# EAGLE design cutoff (EAGLE 7.7.0)
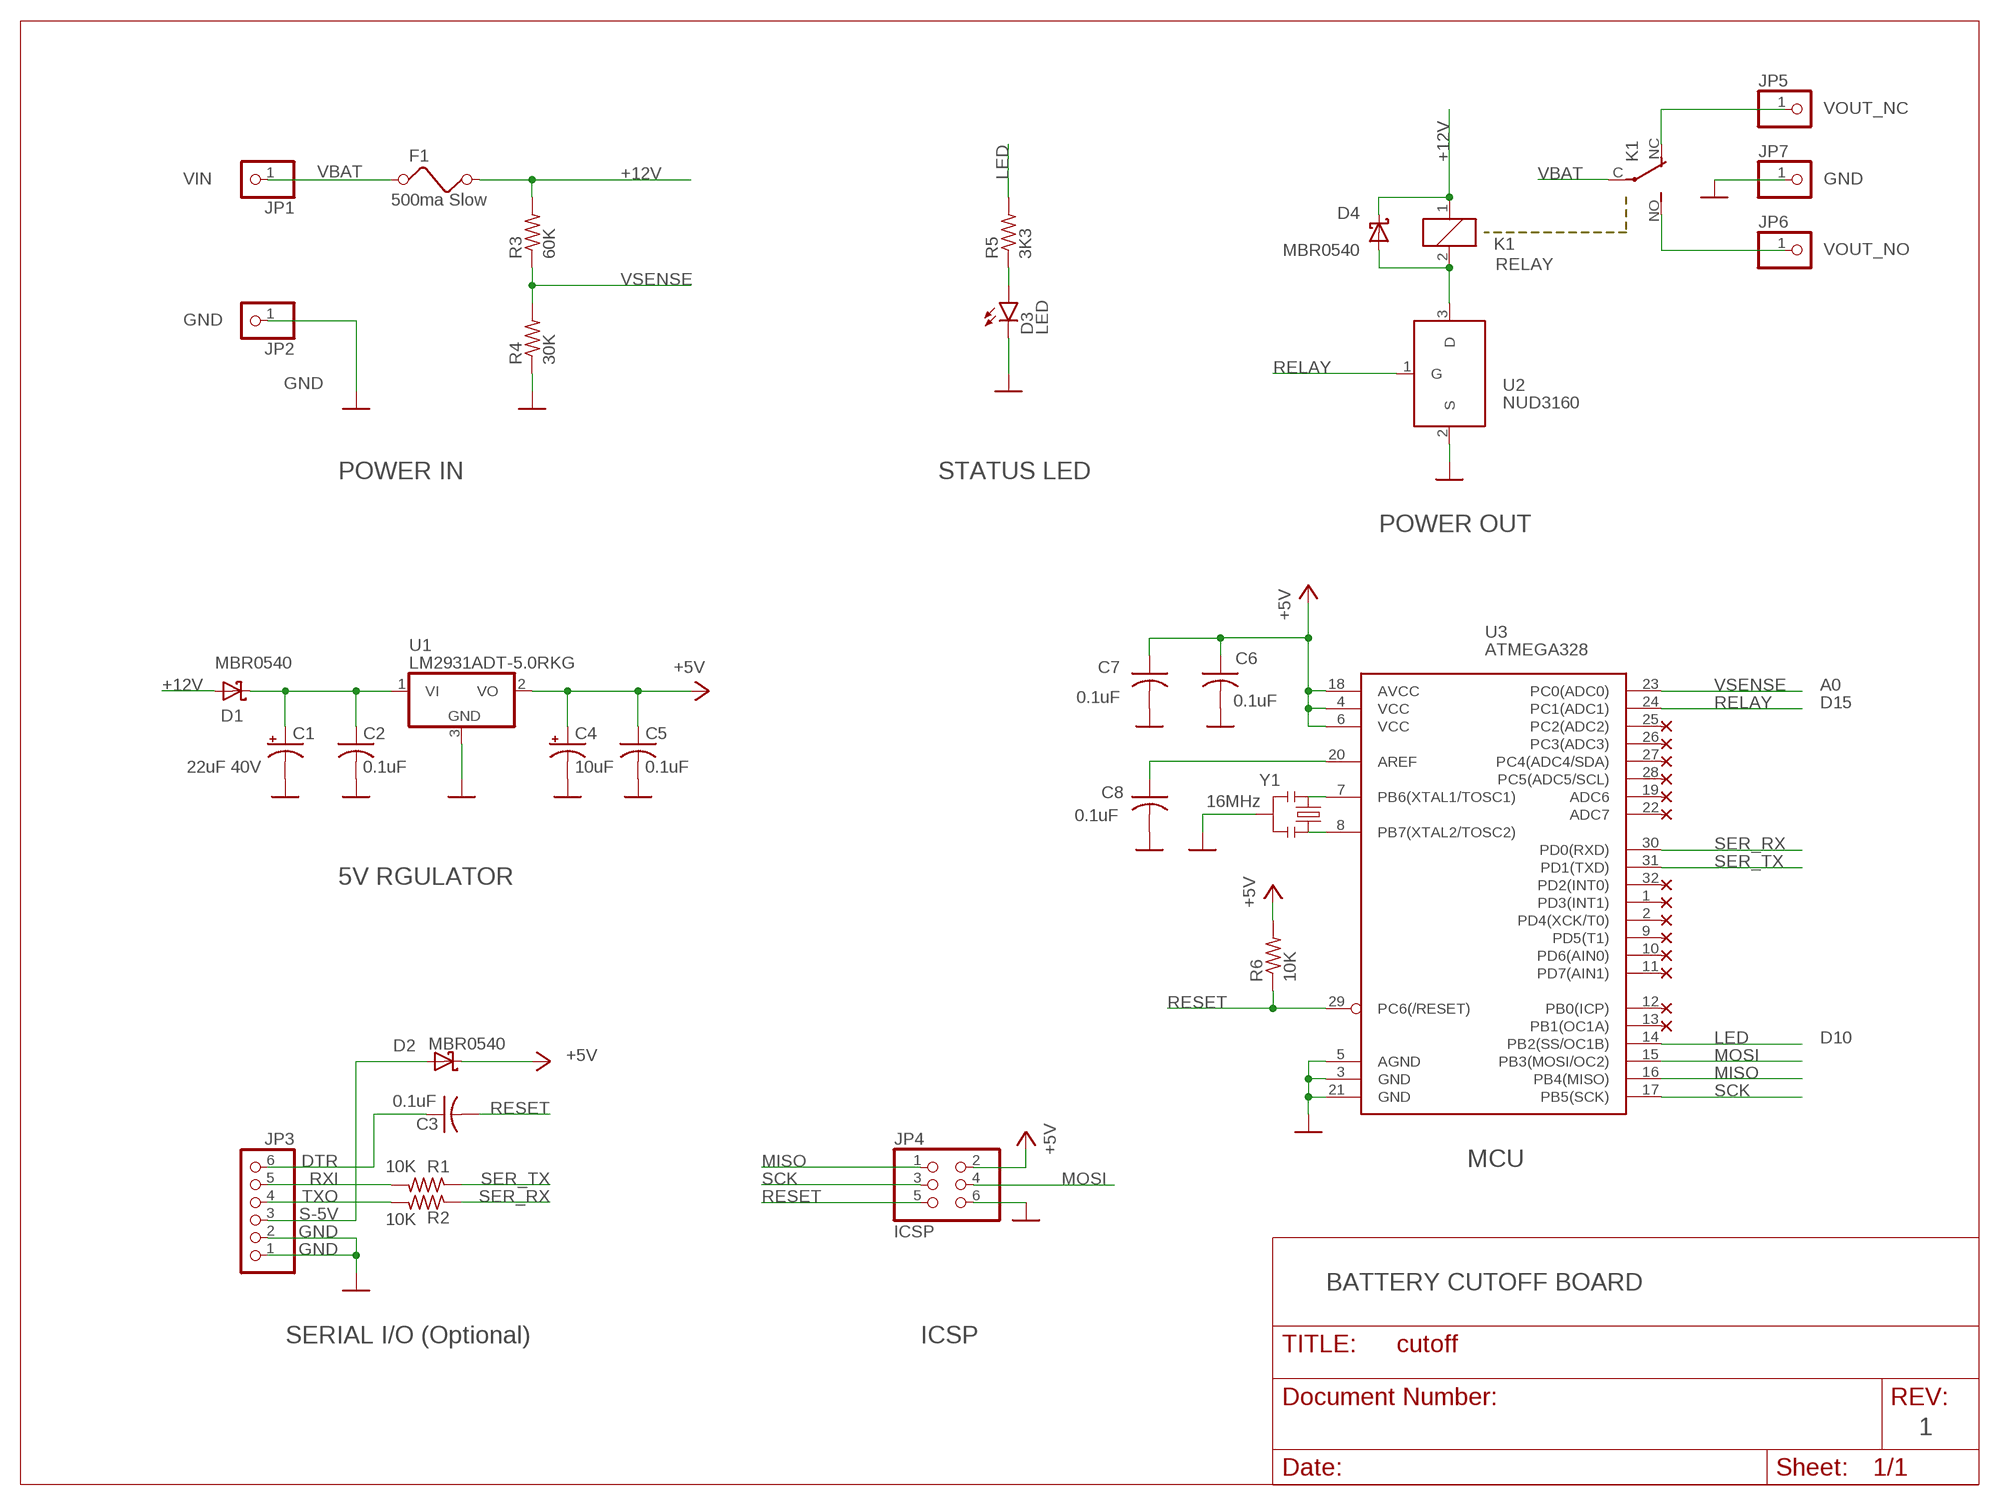
[diagram p0: schematic, sheet 1]

## Parts
C1  22uF 40V  CPOL-USUD-6,3X5,8  [UD-6,3X5,8_NICHICON]
C2  0.1uF  C-USC0603K  [C0603K]
C3  0.1uF  C-USC0603K  [C0603K]
C4  10uF  CPOL-USA/3216-18R  [A/3216-18R]
C5  0.1uF  C-USC0603K  [C0603K]
C6  0.1uF  C-USC0603K  [C0603K]
C7  0.1uF  C-USC0603K  [C0603K]
C8  0.1uF  C-USC0603K  [C0603K]
D1  MBR0540  SMF5.0AT1  [SOD123FL]
D2  MBR0540  SMF5.0AT1  [SOD123FL]
D3  LED  [LED]
D4  MBR0540  SMF5.0AT1  [SOD123FL]
F1  500ma Slow  FUSE  [1206]
JP1  WIRE_PAD  [WIRE_PAD]
JP2  WIRE_PAD  [WIRE_PAD]
JP3  PINHD-1X6  [1X06]
JP4  ICSP  PINHD-2X3  [2X03]
JP5  WIRE_PAD  [WIRE_PAD]
JP6  WIRE_PAD  [WIRE_PAD]
JP7  WIRE_PAD  [WIRE_PAD]
K1  RELAY  [RELAY]
R1  10K  R-US_R0402  [R0402]
R2  10K  R-US_R0402  [R0402]
R3  60K  R-US_R0402  [R0402]
R4  30K  R-US_R0402  [R0402]
R5  3K3  R-US_R0402  [R0402]
R6  10K  R-US_R0402  [R0402]
U1  LM2931ADT-5.0RKG  LDODT  [LDO]
U2  NUD3160  [SOT23]
U3  ATMEGA328  [TQFP32-08]
Y1  16MHz  RESONATORSMD  [RESONATOR-SMD]

## Nets
+5V: C4.+ C5.1 C6.1 C7.1 D2.C JP4.2 R6.2 U1.2(VO) U3.4(VCC) U3.6(VCC) U3.18(AVCC)
+12V: D1.A D4.C F1.2 K1.1 R3.2
AREF: C8.1 U3.20(AREF)
DTR: C3.1 JP3.6
GND: C1.- C2.2 C4.- C5.2 C6.2 C7.2 C8.2 D3.K(C) JP2.1 JP3.1 JP3.2 JP4.6 JP7.1 R4.1 U1.3(GND) U2.2(S) U3.3(GND) U3.5(AGND) U3.21(GND) Y1.2
LED: R5.2 U3.14(PB2(SS/OC1B))
MISO: JP4.1 U3.16(PB4(MISO))
MOSI: JP4.4 U3.15(PB3(MOSI/OC2))
N$1: D4.A K1.2 U2.3(D)
N$3: D3.A R5.1
N$4: JP6.1 K1.NO(2:S)
N$5: JP5.1 K1.NC(2:O)
N$6: C1.+ C2.1 D1.C U1.1(VI)
RELAY: U2.1(G) U3.24(PC1(ADC1))
RESET: C3.2 JP4.5 R6.1 U3.29(PC6(/RESET))
RXI: JP3.5 R1.2
S-5V: D2.A JP3.3
SCK: JP4.3 U3.17(PB5(SCK))
SER_RX: R2.1 U3.30(PD0(RXD))
SER_TX: R1.1 U3.31(PD1(TXD))
TXO: JP3.4 R2.2
VBAT: F1.1 JP1.1 K1.C(2:P)
VSENSE: R3.1 R4.2 U3.23(PC0(ADC0))
XTAL1: U3.7(PB6(XTAL1/TOSC1)) Y1.3
XTAL2: U3.8(PB7(XTAL2/TOSC2)) Y1.1
Unconnected: U3.1(PD3(INT1)) U3.2(PD4(XCK/T0)) U3.9(PD5(T1)) U3.10(PD6(AIN0)) U3.11(PD7(AIN1)) U3.12(PB0(ICP)) U3.13(PB1(OC1A)) U3.19(ADC6) U3.22(ADC7) U3.25(PC2(ADC2)) U3.26(PC3(ADC3)) U3.27(PC4(ADC4/SDA)) U3.28(PC5(ADC5/SCL)) U3.32(PD2(INT0))

## Notes on the sheet
- VOUT_NC
- VIN | GND
- VOUT_NO
- GND
- POWER IN | STATUS LED
- POWER OUT
- A0
- D15
- 5V RGULATOR
- D10
- MCU
- BATTERY CUTOFF BOARD
- SERIAL I/O (Optional) | ICSP
- 1

## Library data of the parts
C1 C4 = beeper:CPOL-US
C2 C3 C5-C8 = resistor:C-US: CAPACITOR, American symbol
D1 D2 D4 = cutoff:SMF5.0AT1
D3 = ir-control:LED
F1 = cutoff:FUSE
JP1 JP2 JP5-JP7 = cutoff:WIRE_PAD: PIN HEADER
JP3 = cutoff:PINHD-1X6
JP4 = cutoff:PINHD-2X3
K1 = cutoff:RELAY: ULTRA-MINIATURE LOW PROFILE AUTOMOTIVE RELAY NAiS Source: http://www.mew-europe.com/.. en_ds_61207_0000.pdf
R1-R6 = resistor:R-US_: RESISTOR, American symbol
U1 = cutoff:LDO
U2 = cutoff:NUD3160
U3 = cutoff:ATMEGA328
Y1 = cutoff:RESONATOR

## Board
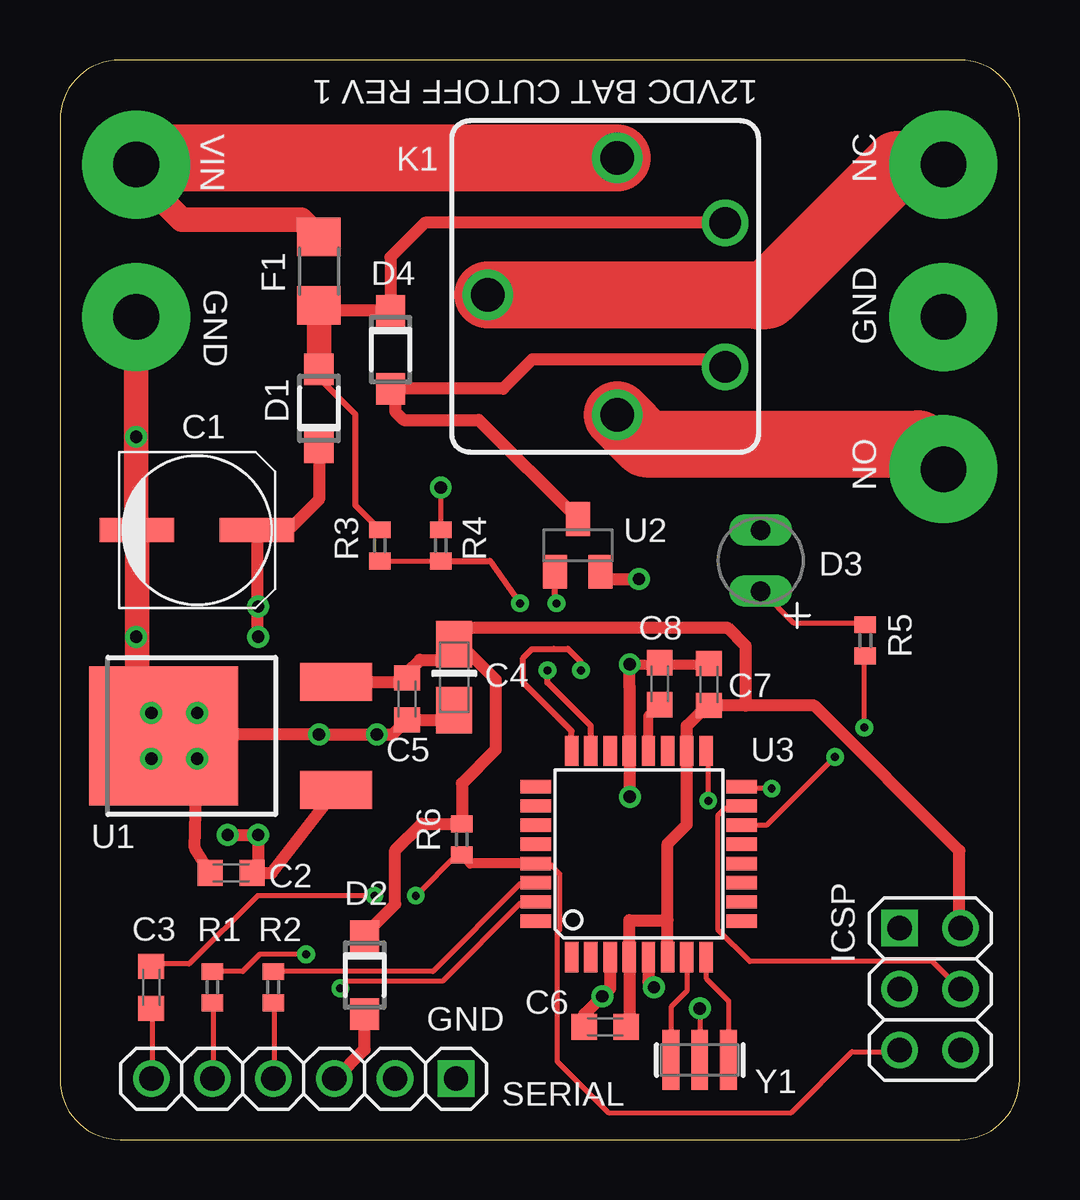
[diagram p1: board, top side]
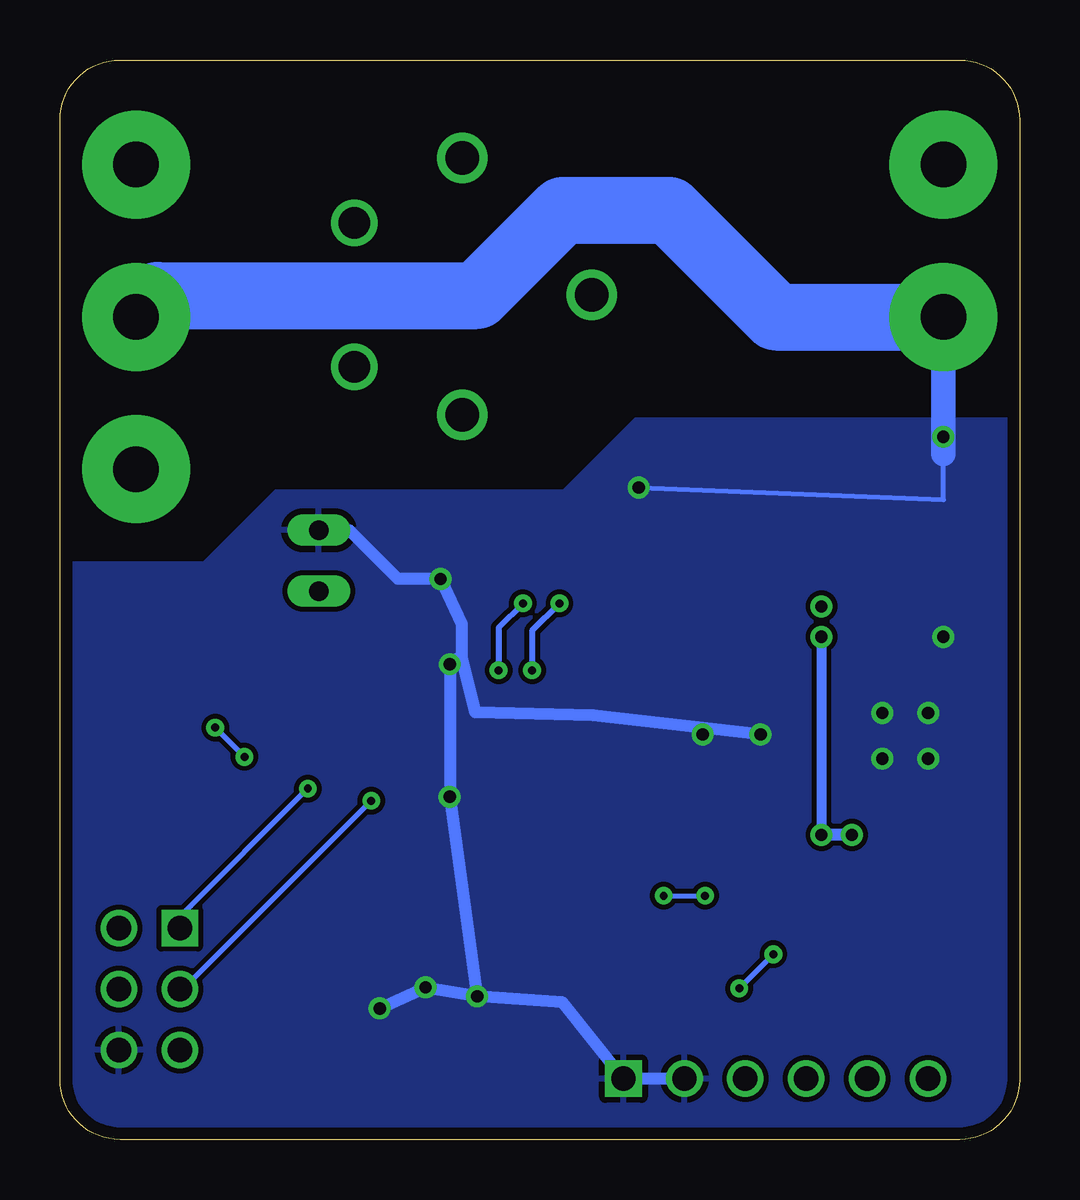
[diagram p2: board, bottom side, seen from below]

Size 40 x 45 mm. Coordinates in mm from the lower left corner, seen from the top.
Outline: 37.5,45 2.5,45 arc90 0,42.5 0,2.5 arc90 2.5,0 37.5,0 arc90 40,2.5 40,42.5 arc90 37.5,45
Copper layers (1*16): Top 0.035mm / dielectric 1.5mm / Bottom 0.035mm
Design rules "default *": minimum track width 8mil, minimum drill 13mil, track to track 8mil, track to pad 8mil, pad to pad 8mil, via to via 8mil, smd to smd 6mil, copper to edge 20mil, drill to drill 8mil, minimum pad ring 10mil, minimum via ring 8mil, stop-mask expansion 4mil, vias tented up to drill 20mil, thermal gap 10mil
tRestrict: area 0.1,30.1 to 2.5,31.2; area 7,14 to 10,20; area 3.2,0 to 17.1,1.9; area 38.1,2.5 to 40,9.5; area 22.9,1.3 to 30.5,1.9; area 12.1,7.1 to 13.3,7.6; area 12.1,5.7 to 13.5,6.3

### Footprints (pad centres in the part's own frame; a part is rotated, then mirrored left to right if it is on the bottom)
UD-6,3X5,8_NICHICON = smd 3.1 x 1: + 2.5,0; - -2.5,0
C0603K = smd 1.05 x 1.08: 1 -0.875,0; 2 0.875,0
A/3216-18R = smd 1.95 x 1.5: + 1.375,0; - -1.375,0
SOD123FL = smd 1.31 x 1.22: A 1.625,0; C -1.625,0
LED = drill 0.813 long: A -1.27,0; K 1.27,0
1206 = smd 1.6 x 1.803: 1 -1.422,0; 2 1.422,0
WIRE_PAD = drill 1.9 pad 4.5: 1 0,0
1X06 = drill 1.016 square: 1 6.35,0 | drill 1.016: 2 3.81,0; 3 1.27,0; 4 -1.27,0; 5 -3.81,0; 6 -6.35,0
2X03 = drill 1.016 square: 1 -2.54,-1.27 | drill 1.016: 2 -2.54,1.27; 3 0,-1.27; 4 0,1.27; 5 2.54,-1.27; 6 2.54,1.27
RELAY = drill 1.3: 1 2.65,-4.5; 2 -3.35,-4.5 | drill 1.4: C 5.35,0; NC -0.35,5.4; NO -5.35,0
R0402 = smd 0.7 x 0.9: 1 -0.65,0; 2 0.65,0
LDO = smd 1.6 x 3: 1 -2.25,-4.68; 2 2.25,-4.68 | smd 5.8 x 6.2: 3 0,2.5
SOT23 = smd 1 x 1.4: 1 -0.95,-1.1; 2 0.95,-1.1; 3 0,1.1
TQFP32-08 = smd 1.27 x 0.559: 1 -4.293,2.8; 2 -4.293,2; 3 -4.293,1.2; 4 -4.293,0.4; 5 -4.293,-0.4; 6 -4.293,-1.2; 7 -4.293,-2; 8 -4.293,-2.8; 17 4.293,-2.8; 18 4.293,-2; 19 4.293,-1.2; 20 4.293,-0.4; 21 4.293,0.4; 22 4.293,1.2; 23 4.293,2; 24 4.293,2.8 | smd 0.559 x 1.27: 9 -2.8,-4.293; 10 -2,-4.293; 11 -1.2,-4.293; 12 -0.4,-4.293; 13 0.4,-4.293; 14 1.2,-4.293; 15 2,-4.293; 16 2.8,-4.293; 25 2.8,4.293; 26 2,4.293; 27 1.2,4.293; 28 0.4,4.293; 29 -0.4,4.293; 30 -1.2,4.293; 31 -2,4.293; 32 -2.8,4.293
RESONATOR-SMD = smd 0.7 x 2.5: 1 -1.2,0; 2 0,0; 3 1.2,0

### Placement (x,y rotation side)
C1  5.71,25.4 0 top
C2  7.13,11.11 180 top
C3  3.81,6.35 90 top
C4  16.43,19.27 90 top
C5  14.46,18.36 270 top
C6  22.73,4.7 180 top
C7  27.05,18.96 90 top
C8  25,19 90 top
D1  10.79,30.48 90 top
D2  12.7,6.86 270 top
D3  29.21,24.13 90 top
D4  13.78,32.92 270 top
F1  10.79,36.2 270 top
JP1  3.17,40.64 0 top
JP2  3.17,34.29 0 top
JP3  10.16,2.54 0 top
JP4  36.27,6.27 270 top
JP5  36.83,40.64 0 top
JP6  36.83,27.94 0 top
JP7  36.83,34.29 0 top
K1  23.23,35.56 90 top
R1  6.35,6.35 270 top
R2  8.89,6.35 270 top
R3  13.34,24.77 90 top
R4  15.88,24.77 270 top
R5  1K  [R0402]  33.57,20.8 270 top
R6  16.75,12.51 90 top
U1  6.83,16.82 90 top
U2  21.59,24.77 0 top
U3  24.13,11.9 90 top
Y1  26.67,3.32 180 top

### Tracks (layer width: path | path; a pad name or v marks a point on that pad's centre or on a via)
+5V
  Top 0.203: 16.2,20.65 C4.+ | C4.+ 16.74,20.95 | 23.73,5.19 23.67,4.98 23.67,4.78 C6.1 23.67,4.67 | 12.7,8.53 D2.C | 37.49,8.74 JP4.2 | 16.51,20.32 16.46,20.32 C4.+
  Top 0.254: 17.02,20.32 16.51,20.32
  Top 0.508: 16.11,20.32 C4.+ 15.79,20 15,20 14.46,19.46 C5.1 14.3,19.07 U1.2 | 23.73,5.19 U3.4 23.73,9.14 25.33,9.14 | 16.74,20.95 17.12,21.34 27.81,21.34 28.57,20.57 28.57,18.09 | U3.6 25.33,9.14 | 25.33,9.14 25.33,12.33 26.13,13.13 U3.18 26.13,17.24 26.91,18.02 C7.1 28.57,18.09 | 37.49,8.74 37.49,12.04 31.44,18.09 28.57,18.09 | 17.02,20.32 18.16,19.18 18.16,16.26 16.75,14.85 R6.2 15.06,13.16 13.97,12.06 13.97,9.8 12.7,8.53
+12V
  Top 0.254: 11,34 11,34.57 F1.2 | R3.2 12.32,26.43 12.32,30.23 10.79,31.75 D1.A
  Top 0.406: 10.79,34.92 F1.2
  Top 0.508: 11,34.57 13.76,34.57 D4.C 13.78,36.78 15.21,38.21 K1.1
  Top 1.016: F1.2 D1.A
AREF
  Top 0.406: U3.20 24.53,17.66 C8.1
DTR
  Top 0.203: C3.1 3.86,5.38 3.86,2.54 JP3.6
GND  (via drill 0.51)
  Top 0.203: R4.1 v15.88,27.18 | v26.67,5.46 Y1.2 | U3.21 23.75,16.18 v23.75,14.29 | v23.75,19.81 23.81,19.88 C8.2
  Top 0.406: U1.3 6.99,15.88 | v23.75,19.81 27.02,19.81 C7.2
  Top 0.508: 3.17,25.44 C1.- | 3.21,18.38 v3.81,17.78 4.33,17.27 U1.3 | U1.3 4.76,16.82 | 4.76,16.82 4.76,16.83 v5.71,17.78 | U1.3 4.33,16.63 4.45,16.51 | 4.45,16.51 v3.81,15.88 | 4.76,16.82 v5.71,15.88 5.62,12.16 C2.2 | 4.83,16.89 4.45,16.51 | 5.08,16.89 v10.79,16.89 v13.21,16.89 13.87,16.89 C5.2 16.02,17.49 C4.- | U3.5 24.53,6.58 v24.77,6.35 | U2.2 22.84,23.37 v24.13,23.37 | v23.75,19.81 23.73,18.9 23.75,18.89 23.75,14.22 | U3.3 22.93,6.29 v22.61,5.97 21.86,5.22 C6.2
  Top 1.016: JP2.1 3.17,25.44 | C1.- 3.21,18.38
  Bottom 0.203: 22.48,5.97 v22.61,5.97 | v15.88,27.18 3.17,26.67 3.17,29.21
  Bottom 0.508: v26.67,5.46 v24.77,6.35 22.48,5.97 | v10.79,16.89 17.78,17.68 22.68,17.81 23.25,20.15 | 23.25,20.15 v23.75,19.81 23.75,14.22 v22.61,5.97 19.05,5.71 JP3.1 JP3.2 | 23.25,20.15 23.25,21.49 v24.13,23.37 25.91,23.37 27.94,25.4 D3.K
  Bottom 1.016: JP2.1 3.17,29.21 3.17,28.57
  Bottom 2.794: JP7.1 35.94,35.18 22.61,35.18 19.05,38.73 14.61,38.73 10.16,34.29 JP2.1
  other vias: 3.17,20.95 3.17,29.29
  pour Bottom: -1,30 16,30 19,27 31,27 34,24 41,24 41,-1 -1,-1
LED  (via drill 0.33)
  Top 0.203: v33.53,17.17 33.53,20.12 R5.2 | v32.31,15.95 29.46,13.11 28.45,13.11 U3.14
  Bottom 0.203: v32.31,15.95 v33.53,17.17
MISO  (via drill 0.33)
  Top 0.203: v29.67,14.63 28.45,14.63 U3.16
  Bottom 0.203: v29.67,14.63 34.95,9.35 34.95,8.84 JP4.1
MOSI
  Top 0.203: U3.15 28.35,13.82 27.74,13.82 27.43,13.51 27.43,8.74 28.75,7.42 36.37,7.42 37.49,6.3 JP4.4
N$1
  Top 0.508: K1.2 27.42,32.51 19.68,32.51 18.47,31.3 D4.A 13.97,31.11 13.97,30.35 14.32,30 17.45,30 U2.3
N$3
  Top 0.203: R5.1 33.53,21.54 30.58,21.54 29.26,22.86 D3.A
N$4
  Top 2.794: K1.NO 24.43,29 35.77,29 JP6.1
N$5
  Top 2.794: K1.NC 28.93,35.21 28.96,35.18 29.46,35.18 34.92,40.64 JP5.1
N$6  (via drill 0.51)
  Top 0.203: v8.26,22.23 8.23,22.25 8.21,22.25
  Top 0.508: D1.C 10.79,26.67 9.53,25.4 C1.+ 8.21,22.25 8.21,21 v8.26,20.95 | v6.99,12.7 v8.26,12.7 8.26,11.49 C2.1 8.82,11.11 U1.1
  Bottom 0.406: v8.26,20.95 v8.26,12.7
  Bottom 0.508: v6.99,12.7 v8.26,12.7
RELAY  (via drill 0.33)
  Top 0.254: v20.7,22.35 20.64,22.54 U2.1 | v21.72,19.56 21.72,19.9 21.17,20.45 20.58,20.45 20.57,20.45 19.68,20.45 19.3,20.07 19.3,19.05 21.33,17.02 U3.24
  Bottom 0.254: v20.7,22.35 21.72,21.34 v21.72,19.56
RESET  (via drill 0.33)
  Top 0.203: v13.11,10.16 8.23,10.16 5.38,7.32 3.86,7.32 C3.2 | v14.83,10.16 16.56,11.89 R6.1 | JP4.5 34.95,3.66 33.02,3.66 30.48,1.12 22.86,1.12 20.73,3.25 20.73,8.64 20.83,8.74 20.83,11.07 20.42,11.48 20.02,11.48 U3.29
  Top 0.406: U3.29 17.11,11.51 R6.1
  Bottom 0.203: v14.83,10.16 v13.11,10.16
RXI
  Top 0.203: R1.2 6.4,5.69 6.4,2.54 JP3.5
S-5V
  Top 0.203: 11.48,2.54 JP3.3
  Top 0.508: D2.A 12.7,3.76 11.48,2.54
SCK  (via drill 0.33)
  Top 0.203: v27.03,14.12 27.03,16.15 U3.17
  Bottom 0.203: v27.03,14.12 34.95,6.2 JP4.3
SER_RX
  Top 0.203: R2.1 8.94,7.01 15.54,7.01 19.2,10.67 19.81,10.67 U3.30
SER_TX  (via drill 0.33)
  Top 0.203: v10.26,7.72 8.33,7.72 7.62,7.01 6.4,7.01 R1.1 | v11.68,6.3 11.99,6.6 15.95,6.6 19.2,9.86 19.81,9.86 U3.31
  Bottom 0.203: v11.68,6.3 v10.26,7.72
TXO
  Top 0.203: R2.2 8.94,5.69 8.94,2.54 JP3.4
VBAT
  Top 1.016: JP1.1 3.17,40.01 3.43,40.01 5.08,38.35 10.06,38.35 F1.1
  Top 2.794: K1.C 3.44,40.91 JP1.1
VSENSE  (via drill 0.33)
  Top 0.203: R3.1 R4.2
  Top 0.254: R4.2 17.92,24.11 v19.18,22.35 | U3.23 22.13,17.24 20.32,19.05 v20.32,19.56
  Bottom 0.254: v19.18,22.35 20.32,21.21 v20.32,19.56
XTAL1
  Top 0.203: U3.7 26.13,6.19 25.47,5.53 Y1.3
XTAL2
  Top 0.203: U3.8 26.93,6.72 27.87,5.79 Y1.1

### Text on the board
tPlace: 12VDC BAT CUTOFF REV 1 | VIN | NC | GND | GND | NO | ICSP | GND | SERIAL